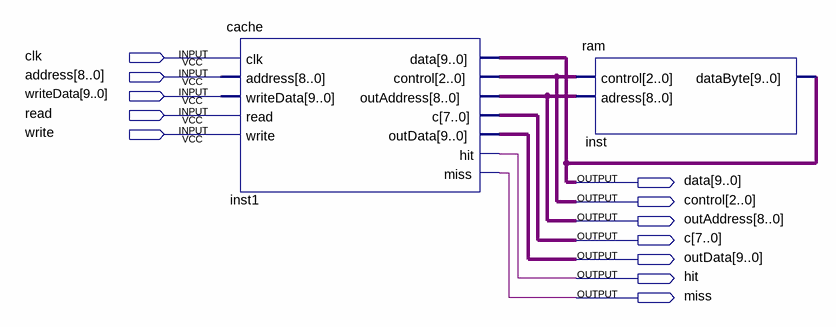
[diagram p0: schematic sheet]
// Quartus schematic Main.bdf as structural Verilog: 2 symbols, 12 pins
module Main (
  input  clk,
  input  [8:0] address,
  input  [9:0] writeData,
  input  read,
  input  write,
  output [9:0] data,
  output [2:0] control,
  output [8:0] outAddress,
  output [7:0] c,
  output [9:0] outData,
  output hit,
  output miss
);

  cache inst1 (
    .clk(clk), .address(address), .writeData(writeData), .read(read), .write(write), .control(control),
    .outAddress(outAddress), .c(c), .outData(outData), .hit(hit), .miss(miss), .data(data));
  ram inst (.control(control), .adress(outAddress), .dataByte(data));
endmodule
